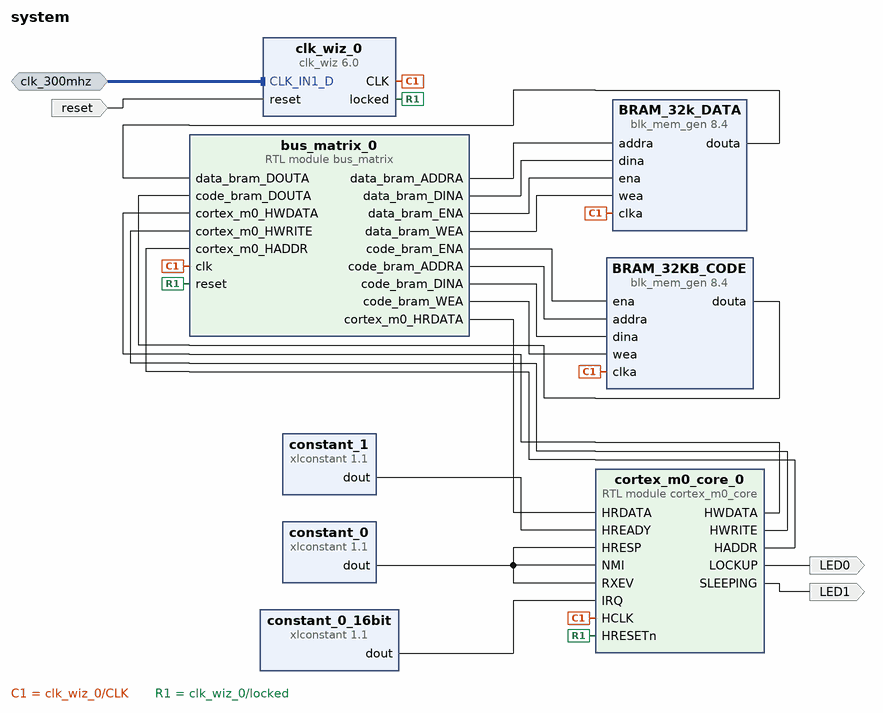
[diagram p0: block diagram of the top level]
# Vivado block design system, xczu7ev-ffvc1156-2-e, Vivado 2019.2
create_bd_design system

create_bd_intf_port -mode Slave -vlnv xilinx.com:interface:diff_clock_rtl:1.0 clk_300mhz
set_property -dict {CONFIG.FREQ_HZ 300000000} [get_bd_intf_ports clk_300mhz]
create_bd_port -dir I -type rst reset
set_property -dict {CONFIG.POLARITY ACTIVE_HIGH} [get_bd_ports reset]
create_bd_port -dir O -type data LED0
create_bd_port -dir O -type data LED1

create_bd_cell -type ip -vlnv xilinx.com:ip:blk_mem_gen:8.4 BRAM_32KB_CODE
set_property -dict [list \
  CONFIG.Coe_File ../../../../program.coe \
  CONFIG.Enable_32bit_Address false \
  CONFIG.Fill_Remaining_Memory_Locations false \
  CONFIG.Load_Init_File true \
  CONFIG.Memory_Type Single_Port_RAM \
  CONFIG.Port_B_Clock 0 \
  CONFIG.Port_B_Enable_Rate 0 \
  CONFIG.Port_B_Write_Rate 0 \
  CONFIG.Read_Width_A 32 \
  CONFIG.Register_PortA_Output_of_Memory_Primitives false \
  CONFIG.Use_Byte_Write_Enable false \
  CONFIG.Use_RSTA_Pin false \
  CONFIG.Write_Depth_A 32768 \
  CONFIG.Write_Width_A 32 \
  CONFIG.use_bram_block Stand_Alone \
] [get_bd_cells BRAM_32KB_CODE]
create_bd_cell -type ip -vlnv xilinx.com:ip:clk_wiz:6.0 clk_wiz_0
set_property -dict [list \
  CONFIG.CLKIN1_JITTER_PS 33.330000000000005 \
  CONFIG.CLKOUT1_JITTER 116.415 \
  CONFIG.CLKOUT1_PHASE_ERROR 77.836 \
  CONFIG.CLKOUT1_REQUESTED_OUT_FREQ 50.000 \
  CONFIG.CLK_IN1_BOARD_INTERFACE clk_300mhz \
  CONFIG.CLK_IN2_BOARD_INTERFACE Custom \
  CONFIG.CLK_OUT1_PORT CLK \
  CONFIG.MMCM_CLKFBOUT_MULT_F 4.000 \
  CONFIG.MMCM_CLKIN1_PERIOD 3.333 \
  CONFIG.MMCM_CLKIN2_PERIOD 10.0 \
  CONFIG.MMCM_CLKOUT0_DIVIDE_F 24.000 \
  CONFIG.MMCM_DIVCLK_DIVIDE 1 \
  CONFIG.PRIM_SOURCE Differential_clock_capable_pin \
  CONFIG.RESET_BOARD_INTERFACE reset \
  CONFIG.USE_BOARD_FLOW true \
] [get_bd_cells clk_wiz_0]
create_bd_cell -type ip -vlnv xilinx.com:ip:xlconstant:1.1 constant_1
create_bd_cell -type ip -vlnv xilinx.com:ip:xlconstant:1.1 constant_0
set_property -dict {CONFIG.CONST_VAL 0} [get_bd_cells constant_0]
create_bd_cell -type ip -vlnv xilinx.com:ip:xlconstant:1.1 constant_0_16bit
set_property -dict {CONFIG.CONST_VAL 0 CONFIG.CONST_WIDTH 16} [get_bd_cells constant_0_16bit]
create_bd_cell -type ip -vlnv xilinx.com:ip:blk_mem_gen:8.4 BRAM_32k_DATA
set_property -dict [list \
  CONFIG.Enable_32bit_Address false \
  CONFIG.Fill_Remaining_Memory_Locations true \
  CONFIG.Register_PortA_Output_of_Memory_Primitives false \
  CONFIG.Use_Byte_Write_Enable false \
  CONFIG.Use_RSTA_Pin false \
  CONFIG.Write_Depth_A 32768 \
  CONFIG.use_bram_block Stand_Alone \
] [get_bd_cells BRAM_32k_DATA]
create_bd_cell -type module -reference bus_matrix bus_matrix_0
create_bd_cell -type module -reference cortex_m0_core cortex_m0_core_0
set_property -dict {CONFIG.S_PROGRAM_MEMORY_ENDIAN true} [get_bd_cells cortex_m0_core_0]

# ---- connections ----

connect_bd_intf_net [get_bd_intf_ports clk_300mhz] [get_bd_intf_pins clk_wiz_0/CLK_IN1_D]
connect_bd_net [get_bd_pins clk_wiz_0/CLK] \
  [get_bd_pins BRAM_32KB_CODE/clka] [get_bd_pins BRAM_32k_DATA/clka] [get_bd_pins bus_matrix_0/clk] \
  [get_bd_pins cortex_m0_core_0/HCLK]
connect_bd_net -net xlconstant_0_dout [get_bd_pins constant_1/dout] [get_bd_pins cortex_m0_core_0/HREADY]
connect_bd_net [get_bd_pins constant_0/dout] \
  [get_bd_pins cortex_m0_core_0/HRESP] [get_bd_pins cortex_m0_core_0/NMI] [get_bd_pins cortex_m0_core_0/RXEV]
connect_bd_net [get_bd_pins constant_0_16bit/dout] [get_bd_pins cortex_m0_core_0/IRQ]
connect_bd_net [get_bd_pins cortex_m0_core_0/LOCKUP] [get_bd_ports LED0]
connect_bd_net [get_bd_pins cortex_m0_core_0/SLEEPING] [get_bd_ports LED1]
connect_bd_net [get_bd_ports reset] [get_bd_pins clk_wiz_0/reset]
connect_bd_net [get_bd_pins clk_wiz_0/locked] [get_bd_pins bus_matrix_0/reset] [get_bd_pins cortex_m0_core_0/HRESETn]
connect_bd_net [get_bd_pins cortex_m0_core_0/HWDATA] [get_bd_pins bus_matrix_0/cortex_m0_HWDATA]
connect_bd_net [get_bd_pins cortex_m0_core_0/HWRITE] [get_bd_pins bus_matrix_0/cortex_m0_HWRITE]
connect_bd_net [get_bd_pins bus_matrix_0/cortex_m0_HRDATA] [get_bd_pins cortex_m0_core_0/HRDATA]
connect_bd_net [get_bd_pins BRAM_32KB_CODE/douta] [get_bd_pins bus_matrix_0/code_bram_DOUTA]
connect_bd_net [get_bd_pins BRAM_32k_DATA/douta] [get_bd_pins bus_matrix_0/data_bram_DOUTA]
connect_bd_net [get_bd_pins bus_matrix_0/code_bram_ENA] [get_bd_pins BRAM_32KB_CODE/ena]
connect_bd_net [get_bd_pins bus_matrix_0/code_bram_ADDRA] [get_bd_pins BRAM_32KB_CODE/addra]
connect_bd_net [get_bd_pins bus_matrix_0/code_bram_DINA] [get_bd_pins BRAM_32KB_CODE/dina]
connect_bd_net [get_bd_pins bus_matrix_0/code_bram_WEA] [get_bd_pins BRAM_32KB_CODE/wea]
connect_bd_net [get_bd_pins bus_matrix_0/data_bram_ADDRA] [get_bd_pins BRAM_32k_DATA/addra]
connect_bd_net [get_bd_pins bus_matrix_0/data_bram_DINA] [get_bd_pins BRAM_32k_DATA/dina]
connect_bd_net [get_bd_pins bus_matrix_0/data_bram_ENA] [get_bd_pins BRAM_32k_DATA/ena]
connect_bd_net [get_bd_pins bus_matrix_0/data_bram_WEA] [get_bd_pins BRAM_32k_DATA/wea]
connect_bd_net [get_bd_pins cortex_m0_core_0/HADDR] [get_bd_pins bus_matrix_0/cortex_m0_HADDR]

validate_bd_design
save_bd_design
